# EAGLE design double-wired-3-face-board (EAGLE 9.6.2)
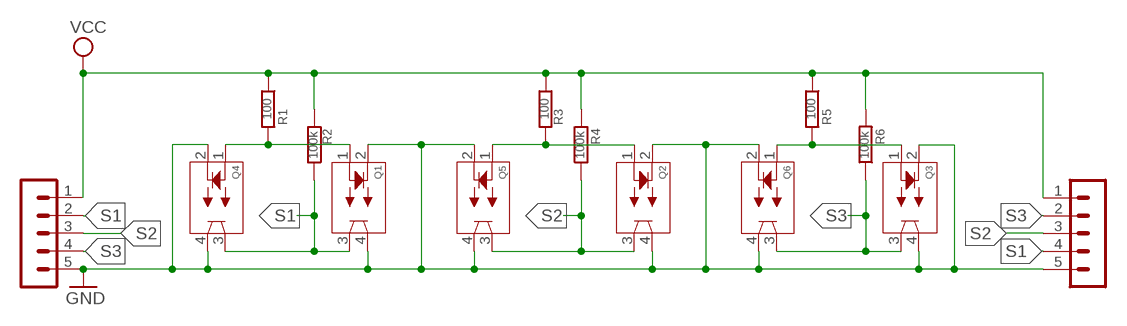
[diagram p0: schematic, sheet 1]

## Parts
Q1  QRE1113  [DIP4_100AQ_ONS]
Q2  QRE1113  [DIP4_100AQ_ONS]
Q3  QRE1113  [DIP4_100AQ_ONS]
Q4  QRE1113  [DIP4_100AQ_ONS]
Q5  QRE1113  [DIP4_100AQ_ONS]
Q6  QRE1113  [DIP4_100AQ_ONS]
R1  100  R-EU_0207/10  [0207/10]
R2  100k  R-EU_0207/10  [0207/10]
R3  100  R-EU_0207/10  [0207/10]
R4  100k  R-EU_0207/10  [0207/10]
R5  100  R-EU_0207/10  [0207/10]
R6  100k  R-EU_0207/10  [0207/10]
SV1  on  MA05-1  [MA05-1]
SV2  on  MA05-1  [MA05-1]

## Nets
5VQ1: Q1.1 Q4.1 R1.2
5VQ2: Q2.1 Q5.1 R3.2
5VQ3: Q3.1 Q6.1 R5.2
GND: Q1.2 Q1.4 Q2.2 Q2.4 Q3.2 Q3.4 Q4.2 Q4.4 Q5.2 Q5.4 Q6.2 Q6.4 SV1.5 SV2.5
S1: Q1.3 Q4.3 R2.1 SV1.4 SV2.2
S2: Q2.3 Q5.3 R4.1 SV1.3 SV2.3
S3: Q3.3 Q6.3 R6.1 SV1.2 SV2.4
VCC: R1.1 R2.2 R3.1 R4.2 R5.1 R6.2 SV1.1 SV2.1

## Library data of the parts
Q1-Q6 = qre1113:QRE1113; COPYRIGHT: Copyright (C) 2024 Ultra Librarian. All rights reserved.; MANUFACTURER_PART_NUMBER: QRE1113; MFR_NAME: onsemi
R1-R6 = rcl:R-EU_: RESISTOR, European symbol; SPICEPREFIX: R
SV1 SV2 = con-lstb:MA05-1: PIN HEADER; OC_FARNELL: unknown; OC_NEWARK: unknown

## Board
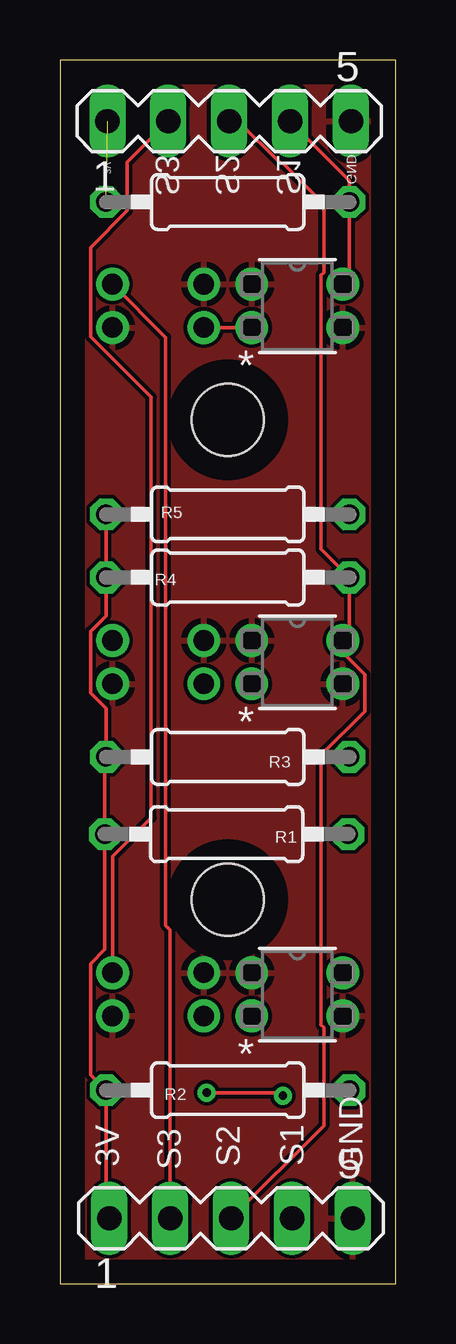
[diagram p1: board, top side]
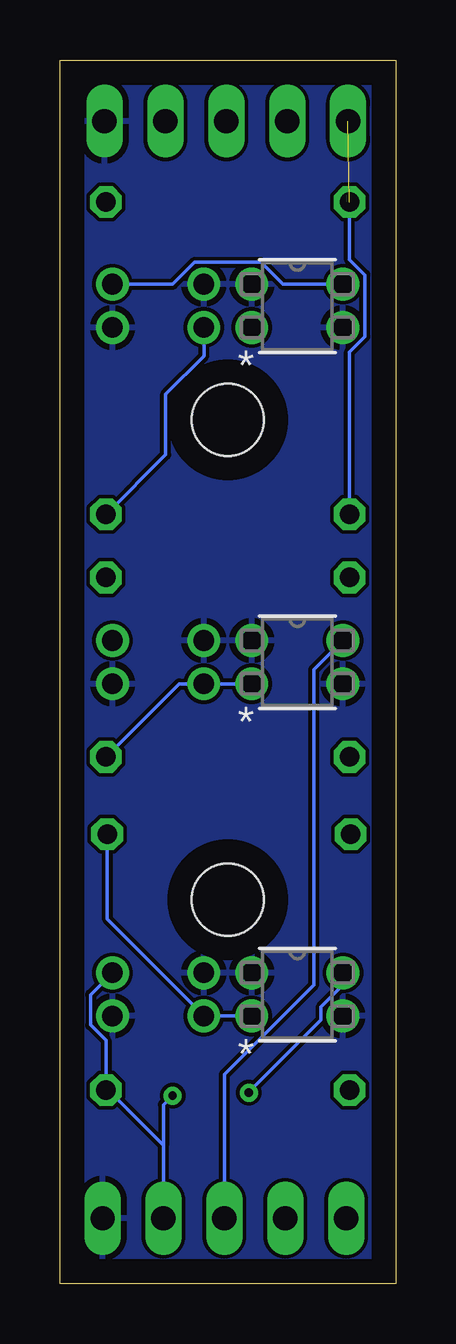
[diagram p2: board, bottom side, seen from below]

Size 14 x 51 mm. Coordinates in mm from the lower left corner, seen from the top.
Outline: 0,0 14,0 14,51 0,51 0,0
Copper layers (1*16): Top 0.035mm / dielectric 1.5mm / Bottom 0.035mm
Design rules "default": minimum track width 6mil, minimum drill 0.35mm, track to track 6mil, track to pad 6mil, pad to pad 6mil, via to via 6mil, smd to smd 6mil, copper to edge 40mil, drill to drill 6mil, minimum pad ring 10mil, minimum via ring 8mil, stop-mask expansion 4mil, vias tented up to drill 0mil, thermal gap 10mil
Holes 3 mm at 7,36 7,16

### Footprints (pad centres in the part's own frame; a part is rotated, then mirrored left to right if it is on the bottom)
DIP4_100AQ_ONS = drill 0.864 pad 1.372: 1 0,0; 2 3.81,0; 3 3.81,1.803; 4 0,1.803
0207/10 = drill 0.813 octagon: 1 -5.08,0; 2 5.08,0
MA05-1 = drill 1.016 long: 1 -5.08,0; 2 -2.54,0; 3 0,0; 4 2.54,0; 5 5.08,0

### Placement (x,y rotation side)
Q1  8,11.15 0 top
Q2  8,25 0 top
Q3  8,39.85 0 top
Q4  6,11.15 0 bottom
Q5  6,25 0 bottom
Q6  6,39.85 0 bottom
R1  6.95,18.73 0 top
R2  7,8.06 180 top
R3  7,21.95 0 top
R4  7,29.43 180 top
R5  7,32.06 0 top
R6  7,45.08 180 top
SV1  7.14,2.72 0 top
SV2  7.06,48.45 0 top

### Tracks (layer width: path | path; a pad name or v marks a point on that pad's centre or on a via)
5VQ1
  Bottom 0.152: Q1.1 7.98,11.15 | 7.98,11.15 Q4.1 | R1.2 12.03,15.2 7.98,11.15
5VQ2
  Bottom 0.152: R3.2 9.03,25 Q2.1 Q5.1
5VQ3
  Top 0.152: Q3.1 Q6.1
  Bottom 0.152: R5.2 9.59,34.55 9.59,37.07 8,38.67 Q3.1
GND
  pour Top: 0,51 14,51 14,0 0,0
  pour Bottom: 0,51 14,51 14,0 0,0
S1  (via drill 0.35)
  Top 0.152: SV2.2 2.81,46.74 2.81,44.71 1.28,43.18 1.28,39.47 3.81,36.94 3.81,19.41 2.19,17.79 Q4.3 | v6.12,7.95 9.18,7.95 v9.3,7.83
  Bottom 0.152: 12.08,8.16 12.08,10.13 12.72,10.77 12.72,12.04 Q1.3 | 12.08,8.16 R2.1 | 9.68,5.76 12.08,8.16 | SV1.4 9.68,5.67 9.68,5.76 | Q4.3 2.19,12.44 3.1,11.53 3.1,11 6.12,7.98 v6.12,7.95 | v9.3,7.83 9.68,7.45 9.68,5.76
S2
  Top 0.152: SV2.3 7.44,48.45 9.19,46.7 9.3,46.7 11,45 11,42.14 10.9,42.03 10.9,30.61 R4.1 12.08,27.07 Q2.3 11.81,26.29 12.72,25.38 12.72,23.85 10.9,22.02 10.9,10.77 11,10.67 11,6.58 SV1.3
  Bottom 0.152: SV1.3 7.14,8.72 3.41,12.45 3.41,25.59 Q5.3
S3
  Top 0.152: SV1.2 4.6,14.73 4.41,14.93 4.41,39.44 Q6.3 | Q3.3 12.08,41.92 R6.1 12.08,45.97 SV2.4
  Bottom 0.152: Q3.3 9.29,41.65 8.38,42.57 5.62,42.57 4.71,41.65 Q6.3
VCC  (1 unrouted)
  Top 0.152: SV1.1 1.92,2.86 R2.2 1.28,8.7 1.28,13.33 1.87,13.93 R1.1 1.87,21.9 R3.1 1.92,23.98 1.28,24.62 1.28,27.18 1.92,27.83 R4.2 R5.1
  Bottom 0.152: R5.1 1.92,38.83 1.28,39.47 1.28,42.03 1.92,42.68 R6.2

### Text on the board
tNames: 3V | GND | S3 | S2 | S1 | 3V | S3 | S2 | S1 | GND